# EAGLE schematic musesb (EAGLE 7.4.0)
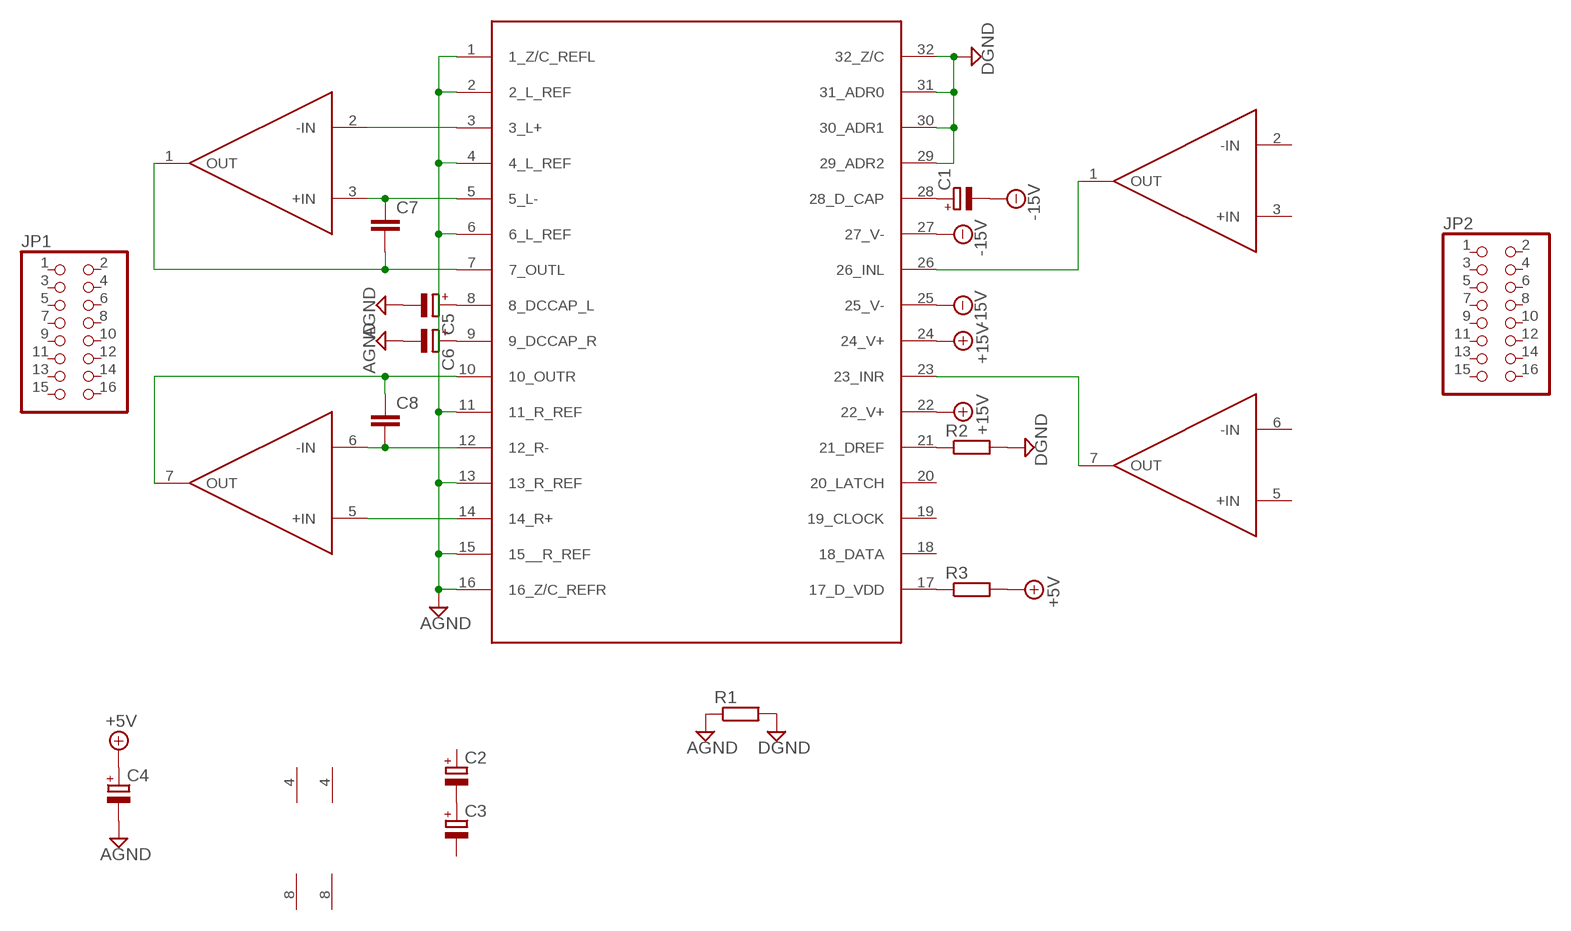
[diagram p0: schematic, sheet 1]

## Parts
C1  CPOL-EUE2.5-6  [E2,5-6]
C2  CPOL-EUE3.5-8  [E3,5-8]
C3  CPOL-EUE3.5-8  [E3,5-8]
C4  CPOL-EUE3.5-8  [E3,5-8]
C5  CPOL-EUE3.5-8  [E3,5-8]
C6  CPOL-EUE3.5-8  [E3,5-8]
C7  C-EU025-025X050  [C025-025X050]
C8  C-EU025-025X050  [C025-025X050]
JP1  PINHD-2X8  [2X08]
JP2  PINHD-2X8  [2X08]
R1  R-EU_0207/7  [0207/7]
R2  R-EU_0207/7  [0207/7]
R3  R-EU_0207/7  [0207/7]
U$1  MUSES72320  [SSOP28DB]
U$2  LME49720  [DIL08]
U$3  LME49720  [DIL08]

## Nets
+5V: C4.+ R3.2
+15V: U$1.22(22_V+) U$1.24(24_V+)
-15V: C1.- U$1.25(25_V-) U$1.27(27_V-)
AGND: C4.- C5.- C6.- R1.1 U$1.1(1_Z/C_REFL) U$1.2(2_L_REF) U$1.4(4_L_REF) U$1.6(6_L_REF) U$1.11(11_R_REF) U$1.13(13_R_REF) U$1.15(15__R_REF) U$1.16(16_Z/C_REFR)
DGND: R1.2 R2.2 U$1.29(29_ADR2) U$1.30(30_ADR1) U$1.31(31_ADR0) U$1.32(32_Z/C)
N$1: U$1.3(3_L+) U$2.2(-IN)
N$2: C7.1 U$1.5(5_L-) U$2.3(+IN)
N$3: U$1.14(14_R+) U$2.5(+IN)
N$4: C8.2 U$1.12(12_R-) U$2.6(-IN)
N$5: U$1.23(23_INR) U$3.7(OUT)
N$6: U$1.26(26_INL) U$3.1(OUT)
N$7: R2.1 U$1.21(21_DREF)
N$8: R3.1 U$1.17(17_D_VDD)
N$9: C1.+ U$1.28(28_D_CAP)
N$10: C2.- C3.+
N$11: C5.+ U$1.8(8_DCCAP_L)
N$12: C6.+ U$1.9(9_DCCAP_R)
N$13: C8.1 U$1.10(10_OUTR) U$2.7(OUT)
N$14: C7.2 U$1.7(7_OUTL) U$2.1(OUT)
Unconnected: C2.+ C3.- JP1.1 JP1.2 JP1.3 JP1.4 JP1.5 JP1.6 JP1.7 JP1.8 JP1.9 JP1.10 JP1.11 JP1.12 JP1.13 JP1.14 JP1.15 JP1.16 JP2.1 JP2.2 JP2.3 JP2.4 JP2.5 JP2.6 JP2.7 JP2.8 JP2.9 JP2.10 JP2.11 JP2.12 JP2.13 JP2.14 JP2.15 JP2.16 U$1.18(18_DATA) U$1.19(19_CLOCK) U$1.20(20_LATCH) U$2.4(V-) U$2.8(V+) U$3.2(-IN) U$3.3(+IN) U$3.4(V-) U$3.5(+IN) U$3.6(-IN) U$3.8(V+)

## Library data of the parts
C1-C6 = Vwvwbg:CPOL-EU: POLARIZED CAPACITOR, European symbol
C7 C8 = Vwvwbg:C-EU: CAPACITOR, European symbol
JP1 JP2 = pinhead:PINHD-2X8: PIN HEADER
R1-R3 = Vwvwbg:R-EU_: RESISTOR, European symbol
U$1 = Vwvwbg:MUSES72320
U$2 U$3 = Vwvwbg:LME49720